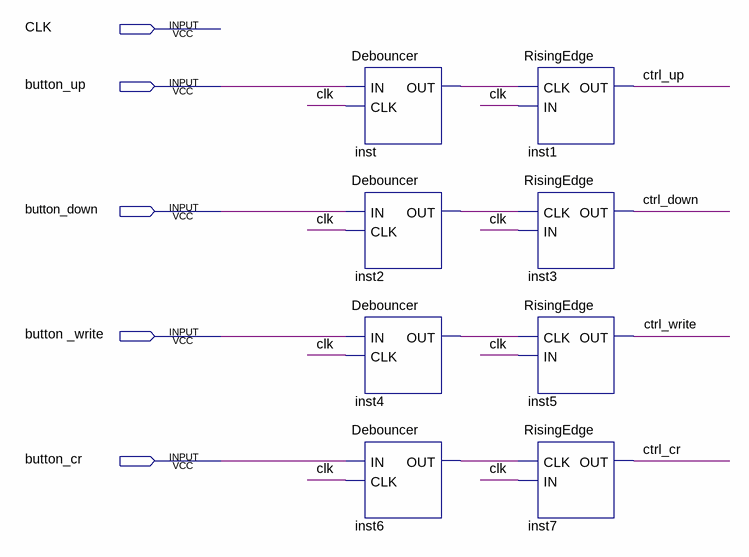
[diagram p0: schematic sheet]
// Quartus schematic dugmici.bdf as structural Verilog: 8 symbols, 5 pins
module dugmici (
  input  CLK,
  input  button_up,
  input  button_down,
  input  \button__write ,
  input  button_cr
);

  wire ctrl_cr, ctrl_down, ctrl_up, ctrl_write, inst2_out, inst4_out, inst6_out, inst_out;

  Debouncer inst (.IN(button_up), .CLK(CLK), .OUT(inst_out));
  Debouncer inst2 (.IN(button_down), .CLK(CLK), .OUT(inst2_out));
  Debouncer inst4 (.IN(\button__write ), .CLK(CLK), .OUT(inst4_out));
  Debouncer inst6 (.IN(button_cr), .CLK(CLK), .OUT(inst6_out));
  RisingEdge inst1 (.CLK(inst_out), .IN(CLK), .OUT(ctrl_up));
  RisingEdge inst3 (.CLK(inst2_out), .IN(CLK), .OUT(ctrl_down));
  RisingEdge inst5 (.CLK(inst4_out), .IN(CLK), .OUT(ctrl_write));
  RisingEdge inst7 (.CLK(inst6_out), .IN(CLK), .OUT(ctrl_cr));
endmodule
